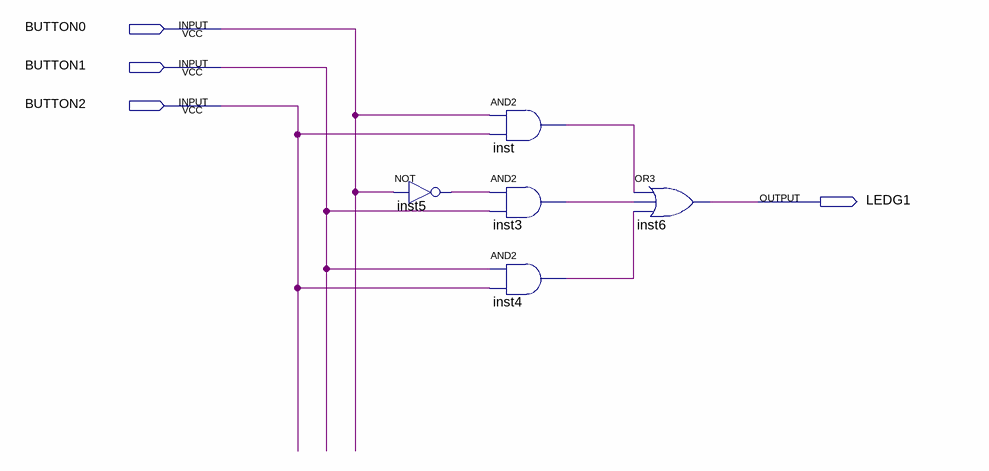
[diagram p0: schematic sheet]
// Quartus schematic Block2.bdf as structural Verilog: 5 symbols, 4 pins
module Block2 (
  input  BUTTON0,
  input  BUTTON1,
  input  BUTTON2,
  output LEDG1
);

  wire inst3_out, inst4_out, inst5_out, inst_out;

  not inst5 (inst5_out, BUTTON0);
  and inst (inst_out, BUTTON0, BUTTON2);
  and inst3 (inst3_out, inst5_out, BUTTON1);
  and inst4 (inst4_out, BUTTON1, BUTTON2);
  or inst6 (LEDG1, inst_out, inst3_out, inst4_out);
endmodule
